# Altium schematic sheet Core_h750vb.SchDoc
size A3
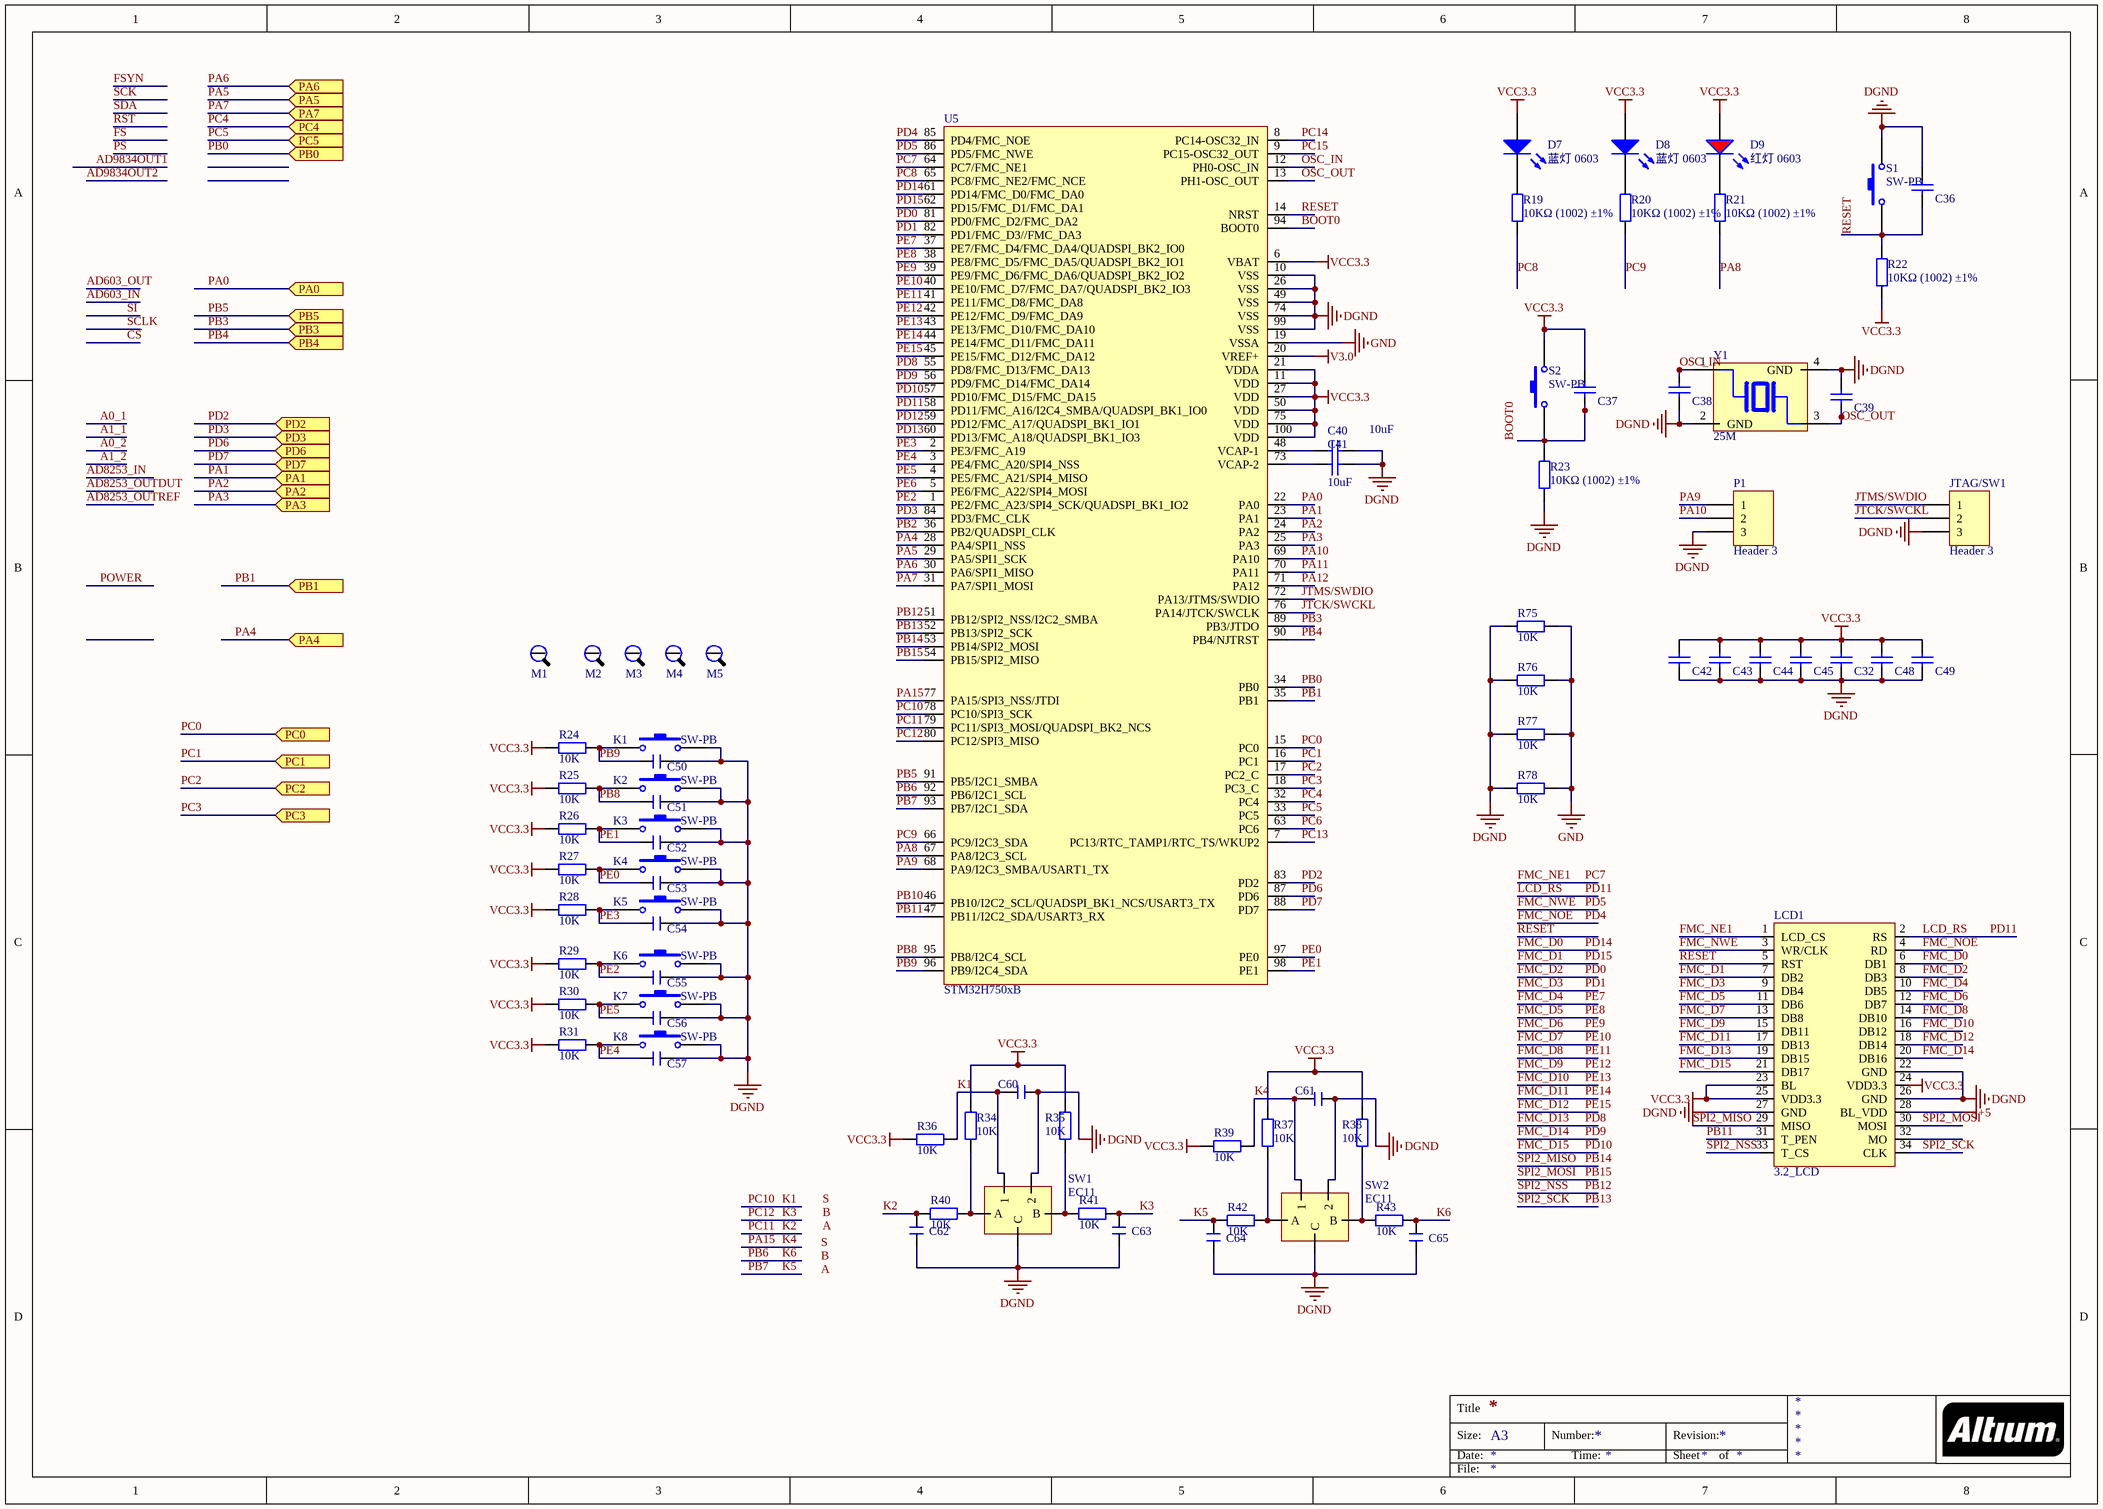
[diagram p0: Core_h750vb.SchDoc]

## Parts
C32  100nF (104) 10% 50V  [0603_C]  (value not drawn)
C36  100nF (104) 10% 50V  [0603_C]  (value not drawn)
C37  100nF (104) 10% 50V  [0603_C]  (value not drawn)
C38  100nF (104) 10% 50V  [0603_C]  (value not drawn)
C39  100nF (104) 10% 50V  [0603_C]  (value not drawn)
C40  10uF  [0603_C]
C41  10uF  [0603_C]
C42  100nF (104) 10% 50V  [0603_C]  (value not drawn)
C43  100nF (104) 10% 50V  [0603_C]  (value not drawn)
C44  100nF (104) 10% 50V  [0603_C]  (value not drawn)
C45  100nF (104) 10% 50V  [0603_C]  (value not drawn)
C48  100nF (104) 10% 50V  [0603_C]  (value not drawn)
C49  100nF (104) 10% 50V  [0603_C]  (value not drawn)
C50  104  [0603_C]  (value not drawn)
C51  104  [0603_C]  (value not drawn)
C52  104  [0603_C]  (value not drawn)
C53  104  [0603_C]  (value not drawn)
C54  104  [0603_C]  (value not drawn)
C55  104  [0603_C]  (value not drawn)
C56  104  [0603_C]  (value not drawn)
C57  104  [0603_C]  (value not drawn)
C60  104  [0603_C]  (value not drawn)
C61  104  [0603_C]  (value not drawn)
C62  104  [0603_C]  (value not drawn)
C63  104  [0603_C]  (value not drawn)
C64  104  [0603_C]  (value not drawn)
C65  104  [0603_C]  (value not drawn)
D7  蓝灯 0603  [0603_LED_S1]
D8  蓝灯 0603  [0603_LED_S1]
D9  红灯 0603  [0603_LED_S1]
JTAG/SW1  Header 3  [HDR1X3]
K1  SW-PB  [SW_PB2_A1]
K2  SW-PB  [SW_PB2_A1]
K3  SW-PB  [SW_PB2_A1]
K4  SW-PB  [SW_PB2_A1]
K5  SW-PB  [SW_PB2_A1]
K6  SW-PB  [SW_PB2_A1]
K7  SW-PB  [SW_PB2_A1]
K8  SW-PB  [SW_PB2_A1]
LCD1  3.2_LCD  [LCD_3.2]
M1  M3  [M3x10_L]  (value not drawn)
M2  M3  [M3x10_L]  (value not drawn)
M3  M3  [M3x10_L]  (value not drawn)
M4  M3  [M3x10_L]  (value not drawn)
M5  M3  [M3x10_L]  (value not drawn)
P1  Header 3  [HDR1X3]
R19  10KΩ (1002) ±1%  [0603_R]
R20  10KΩ (1002) ±1%  [0603_R]
R21  10KΩ (1002) ±1%  [0603_R]
R22  10KΩ (1002) ±1%  [0603_R]
R23  10KΩ (1002) ±1%  [0603_R]
R24  10K  [0603-1]
R25  10K  [0603-1]
R26  10K  [0603-1]
R27  10K  [0603-1]
R28  10K  [0603-1]
R29  10K  [0603-1]
R30  10K  [0603-1]
R31  10K  [0603-1]
R34  10K  [0603-1]
R35  10K  [0603-1]
R36  10K  [0603-1]
R37  10K  [0603-1]
R38  10K  [0603-1]
R39  10K  [0603-1]
R40  10K  [0603-1]
R41  10K  [0603-1]
R42  10K  [0603-1]
R43  10K  [0603-1]
R75  10K  [0603-1]
R76  10K  [0603-1]
R77  10K  [0603-1]
R78  10K  [0603-1]
S1  SW-PB  [SW_PB2_A1]
S2  SW-PB  [SW_PB2_A1]
SW1  EC11  [EC11]
SW2  EC11  [EC11]
U5  STM32H750xB  [TQFP100_M]
Y1  value 25M  [OSC 3225-4P]  (hidden comment: CRYSTAL)

## Ports
PA0 (in), PA1 (in), PA2 (in), PA3 (in), PA4 (in), PA5 (in), PA6 (in), PA7 (in), PB0 (in), PB1 (in), PB3 (in), PB4 (in), PB5 (in), PC0 (in), PC1 (in), PC2 (in), PC3 (in), PC4 (in), PC5 (in), PD2 (in), PD3 (in), PD6 (in), PD7 (in)

## Nets
+5: LCD1.28(BL_VDD)
DGND: C32.2 C36.1 C38.2 C39.1 C40.1 C41.1 C42.2 C43.2 C44.2 C45.2 C48.2 C49.2 C50.2 C51.2 C52.2 C53.2 C54.2 C55.2 C56.2 C57.2 C60.1 C61.1 C62.2 C63.2 C64.2 C65.2 JTAG/SW1.3 K1.2 K2.2 K3.2 K4.2 K5.2 K6.2 K7.2 K8.2 LCD1.22(GND) LCD1.26(GND) LCD1.27(GND) P1.3 R23.1 R75.2 R76.2 R77.2 R78.2 S1.2 SW1.2 SW1.C SW2.2 SW2.C U5.10(VSS) U5.26(VSS) U5.49(VSS) U5.74(VSS) U5.99(VSS) Y1.2(GND) Y1.4(GND)
GND: R75.1 R76.1 R77.1 R78.1 U5.19(VSSA)
V3.0: U5.20(VREF+)
VCC3.3: C32.1 C37.1 C42.1 C43.1 C44.1 C45.1 C48.1 C49.1 D7.A D8.A D9.A LCD1.23(BL) LCD1.24(VDD3.3) LCD1.25(VDD3.3) R22.1 R24.2 R25.2 R26.2 R27.2 R28.2 R29.2 R30.2 R31.2 R34.2 R35.2 R36.1 R37.2 R38.2 R39.1 S2.2 U5.6(VBAT) U5.11(VDD) U5.21(VDDA) U5.27(VDD) U5.50(VDD) U5.75(VDD) U5.100(VDD)
BOOT0: C37.2 R23.2 S2.1 U5.94(BOOT0)
FMC_D0: LCD1.6(DB1) U5.61(PD14/FMC_D0/FMC_DA0)  [also labelled PD14]
FMC_D1: LCD1.7(DB2) U5.62(PD15/FMC_D1/FMC_DA1)  [also labelled PD15]
FMC_D2: LCD1.8(DB3) U5.81(PD0/FMC_D2/FMC_DA2)  [also labelled PD0]
FMC_D3: LCD1.9(DB4) U5.82(PD1/FMC_D3//FMC_DA3)  [also labelled PD1]
FMC_D4: LCD1.10(DB5) U5.37(PE7/FMC_D4/FMC_DA4/QUADSPI_BK2_IO0)  [also labelled PE7]
FMC_D5: LCD1.11(DB6) U5.38(PE8/FMC_D5/FMC_DA5/QUADSPI_BK2_IO1)  [also labelled PE8]
FMC_D6: LCD1.12(DB7) U5.39(PE9/FMC_D6/FMC_DA6/QUADSPI_BK2_IO2)  [also labelled PE9]
FMC_D7: LCD1.13(DB8) U5.40(PE10/FMC_D7/FMC_DA7/QUADSPI_BK2_IO3)  [also labelled PE10]
FMC_D8: LCD1.14(DB10) U5.41(PE11/FMC_D8/FMC_DA8)  [also labelled PE11]
FMC_D9: LCD1.15(DB11) U5.42(PE12/FMC_D9/FMC_DA9)  [also labelled PE12]
FMC_D10: LCD1.16(DB12) U5.43(PE13/FMC_D10/FMC_DA10)  [also labelled PE13]
FMC_D11: LCD1.17(DB13) U5.44(PE14/FMC_D11/FMC_DA11)  [also labelled PE14]
FMC_D12: LCD1.18(DB14) U5.45(PE15/FMC_D12/FMC_DA12)  [also labelled PE15]
FMC_D13: LCD1.19(DB15) U5.55(PD8/FMC_D13/FMC_DA13)  [also labelled PD8]
FMC_D14: LCD1.20(DB16) U5.56(PD9/FMC_D14/FMC_DA14)  [also labelled PD9]
FMC_D15: LCD1.21(DB17) U5.57(PD10/FMC_D15/FMC_DA15)  [also labelled PD10]
FMC_NE1: LCD1.1(LCD_CS) U5.64(PC7/FMC_NE1)  [also labelled PC7]
FMC_NOE: LCD1.4(RD) U5.85(PD4/FMC_NOE)  [also labelled PD4]
FMC_NWE: LCD1.3(WR/CLK) U5.86(PD5/FMC_NWE)  [also labelled PD5]
JTCK/SWCKL: JTAG/SW1.2 U5.76(PA14/JTCK/SWCLK)
JTMS/SWDIO: JTAG/SW1.1 U5.72(PA13/JTMS/SWDIO)
K1: C60.2 R36.2 SW1.1 U5.78(PC10/SPI3_SCK)  [also labelled PC10]
K2: C62.1 R40.1 U5.79(PC11/SPI3_MOSI/QUADSPI_BK2_NCS)  [also labelled PC11]
K3: C63.1 R41.2 U5.80(PC12/SPI3_MISO)  [also labelled PC12]
K4: C61.2 R39.2 SW2.1 U5.77(PA15/SPI3_NSS/JTDI)  [also labelled PA15]
K5: C64.1 R42.1 U5.93(PB7/I2C1_SDA)  [also labelled PB7]
K6: C65.1 R43.2 U5.92(PB6/I2C1_SCL)  [also labelled PB6]
LCD_RS: LCD1.2(RS) U5.58(PD11/FMC_A16/I2C4_SMBA/QUADSPI_BK1_IO0)  [also labelled PD11]
OSC_IN: C38.1 U5.12(PH0-OSC_IN) Y1.1
OSC_OUT: C39.2 U5.13(PH1-OSC_OUT) Y1.3
PA0: U5.22(PA0) ; port PA0
PA1: U5.23(PA1) ; port PA1
PA2: U5.24(PA2) ; port PA2
PA3: U5.25(PA3) ; port PA3
PA4: U5.28(PA4/SPI1_NSS) ; port PA4
PA5: U5.29(PA5/SPI1_SCK) ; port PA5
PA6: U5.30(PA6/SPI1_MISO) ; port PA6
PA7: U5.31(PA7/SPI1_MOSI) ; port PA7
PA8: R21.1 U5.67(PA8/I2C3_SCL)
PA9: P1.1 U5.68(PA9/I2C3_SMBA/USART1_TX)
PA10: P1.2 U5.69(PA10)
PA11: U5.70(PA11)
PA12: U5.71(PA12)
PB0: U5.34(PB0) ; port PB0
PB1: U5.35(PB1) ; port PB1
PB2: U5.36(PB2/QUADSPI_CLK)
PB3: U5.89(PB3/JTDO) ; port PB3
PB4: U5.90(PB4/NJTRST) ; port PB4
PB5: U5.91(PB5/I2C1_SMBA) ; port PB5
PB8: C51.1 K2.1 R25.1 U5.95(PB8/I2C4_SCL)
PB9: C50.1 K1.1 R24.1 U5.96(PB9/I2C4_SDA)
PB10: U5.46(PB10/I2C2_SCL/QUADSPI_BK1_NCS/USART3_TX)
PB11: LCD1.31(T_PEN) U5.47(PB11/I2C2_SDA/USART3_RX)
PB12: LCD1.33(T_CS) U5.51(PB12/SPI2_NSS/I2C2_SMBA)  [also labelled SPI2_NSS]
PB13: LCD1.34(CLK) U5.52(PB13/SPI2_SCK)  [also labelled SPI2_SCK]
PB14: LCD1.29(MISO) U5.53(PB14/SPI2_MOSI)  [also labelled SPI2_MISO]
PB15: LCD1.30(MOSI) U5.54(PB15/SPI2_MISO)  [also labelled SPI2_MOSI]
PC0: U5.15(PC0) ; port PC0
PC1: U5.16(PC1) ; port PC1
PC2: U5.17(PC2_C) ; port PC2
PC3: U5.18(PC3_C) ; port PC3
PC4: U5.32(PC4) ; port PC4
PC5: U5.33(PC5) ; port PC5
PC6: U5.63(PC6)
PC8: R19.1 U5.65(PC8/FMC_NE2/FMC_NCE)
PC9: R20.1 U5.66(PC9/I2C3_SDA)
PC13: U5.7(PC13/RTC_TAMP1/RTC_TS/WKUP2)
PC14: U5.8(PC14-OSC32_IN)
PC15: U5.9(PC15-OSC32_OUT)
PD2: U5.83(PD2) ; port PD2
PD3: U5.84(PD3/FMC_CLK) ; port PD3
PD6: U5.87(PD6) ; port PD6
PD7: U5.88(PD7) ; port PD7
PD12: U5.59(PD12/FMC_A17/QUADSPI_BK1_IO1)
PD13: U5.60(PD13/FMC_A18/QUADSPI_BK1_IO3)
PE0: C53.1 K4.1 R27.1 U5.97(PE0)
PE1: C52.1 K3.1 R26.1 U5.98(PE1)
PE2: C55.1 K6.1 R29.1 U5.1(PE2/FMC_A23/SPI4_SCK/QUADSPI_BK1_IO2)
PE3: C54.1 K5.1 R28.1 U5.2(PE3/FMC_A19)
PE4: C57.1 K8.1 R31.1 U5.3(PE4/FMC_A20/SPI4_NSS)
PE5: C56.1 K7.1 R30.1 U5.4(PE5/FMC_A21/SPI4_MISO)
PE6: U5.5(PE6/FMC_A22/SPI4_MOSI)
RESET: C36.2 LCD1.5(RST) R22.2 S1.1 U5.14(NRST)
NetC40_2: C40.2 U5.48(VCAP-1)
NetC41_2: C41.2 U5.73(VCAP-2)
NetD7_K: D7.K R19.2
NetD8_K: D8.K R20.2
NetD9_K: D9.K R21.2
NetR34_1: R34.1 R40.2 SW1.A
NetR35_1: R35.1 R41.1 SW1.B
NetR37_1: R37.1 R42.2 SW2.A
NetR38_1: R38.1 R43.1 SW2.B

Not connected (* = marked no-connect by the designer): LCD1 32(MO); M1 1; M2 1; M3 1; M4 1; M5 1

## Notes on the sheet
- Labels drawn without touching a wire or pin: A, B, S
- Title
- Size:
- Date:
- A3
- Number:
- Time:
- Revision:
- Sheet
- of
- File:

## Library data of the parts
C32 C36-C39 C42-C45 C48 C49 = 0603 100nF (104) 10% 50V: 贴片电容; ComponentLink1Description: 供应商链接; ComponentLink1URL: http://www.szlcsc.com/product/details_15331.html; Package: 0603; Supplier: LC; SuppliersPartNumber: C14663
C40 C41 = 0603 10uF (106) 10% 10V: 贴片电容; ComponentLink1Description: 供应商链接; ComponentLink1URL: http://www.szlcsc.com/product/details_20411.html; Package: 0603; Supplier: LC; SuppliersPartNumber: C19702
C50-C57 C60-C65 = C: 无极性贴片电容; 淘宝ID: 黄晶宝石; BOM名称: 无极性贴片电容; 学习资源: https://shop463601444.taobao.com
D7 D8 = 0603 蓝灯: 发光二极管; ComponentLink1Description: 供应商链接; ComponentLink1URL: http://www.szlcsc.com/product/details_73150.html; Package: 0603; Supplier: LC; SuppliersPartNumber: C72041
D9 = 0603 红灯: 发光二极管; ComponentLink1Description: 供应商链接; ComponentLink1URL: http://www.szlcsc.com/product/details_2659.html; Package: 0603; Supplier: LC; SuppliersPartNumber: C2286
JTAG/SW1 P1 = Header 3: Header, 3-Pin; LatestRevisionDate: 17-Jul-2002; LatestRevisionNote: Re-released for DXP Platform.; Publisher: Altium Limited
K1-K8 S1 S2 = SW-PB: 微动开关; Published: 24-Mar-1999; LatestRevisionDate: 17-Jul-2002; LatestRevisionNote: Re-released for DXP Platform.; PackageReference: SPST-2; Publisher: Altium Limited
M1-M5 = ELSE_M3_screw: 螺丝
R19-R23 = 0603 10KΩ (1002) 1%: 贴片电阻; ComponentLink1Description: 供应商链接; ComponentLink1URL: http://www.szlcsc.com/product/details_26547.html; Package: 0603; Supplier: LC; SuppliersPartNumber: C25804
R24-R31 R34-R43 R75-R78 = Res1: 贴片电阻; Published: 8-Jun-2000; LatestRevisionDate: 17-Jul-2002; LatestRevisionNote: Re-released for DXP Platform.; PackageReference: AXIAL-0.4; Publisher: Altium Limited; Value: 10K
SW1 SW2 = SWTICH_EC11_ENCODER
U5 = IC_STM32H750xB
Y1 = CRYSTAL_晶振25M_3225